# Altium schematic sheet BMS_Switch_and_batteries.SchDoc
size A4
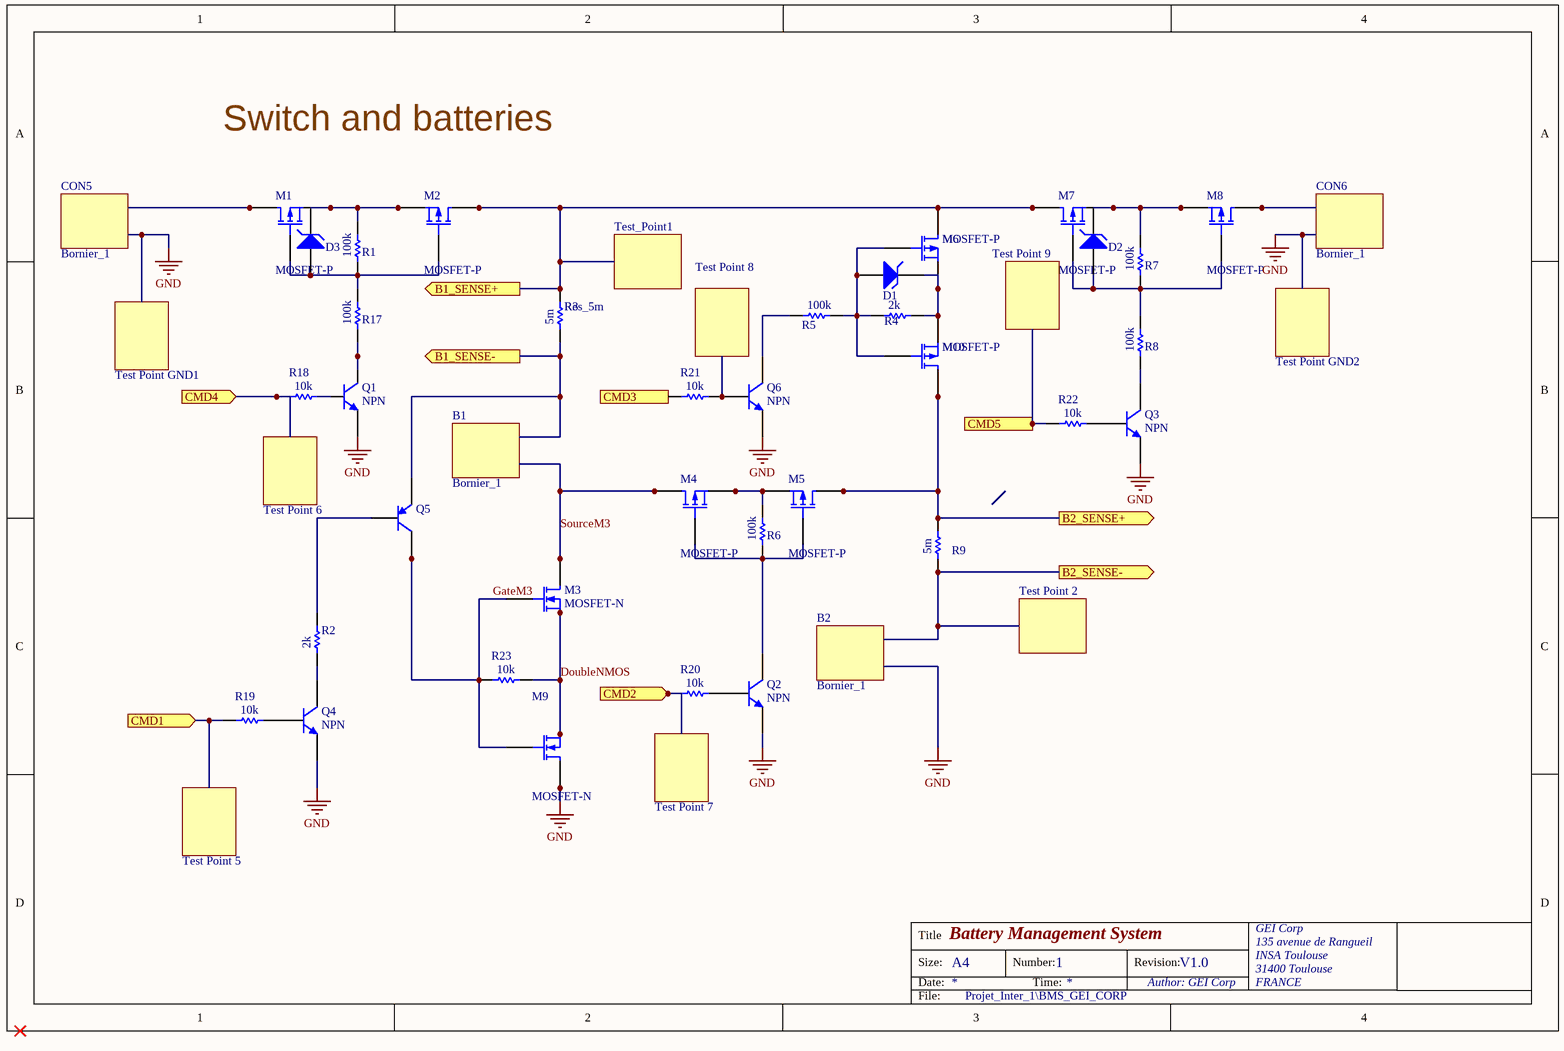
[diagram p0: BMS_Switch_and_batteries.SchDoc]

## Parts
B1  Bornier_1  [Block_2Position]
B2  Bornier_1  [Block_2Position]
CON5  Bornier_1  [Block_2Position]
CON6  Bornier_1  [Block_2Position]
D1  D Zener  [SOT95P230X110-3N_ZENER]  (value not drawn)
D2  D Zener  [SOT95P230X110-3N_ZENER]  (value not drawn)
D3  D Zener  [SOT95P230X110-3N_ZENER]  (value not drawn)
M1  MOSFET-P  [Vishay_S17-0173-SINGLE_MFG]
M2  MOSFET-P  [Vishay_S17-0173-SINGLE_MFG]
M3  MOSFET-N  [Vishay_S17-0173-SINGLE_MFG]
M4  MOSFET-P  [Vishay_S17-0173-SINGLE_MFG]
M5  MOSFET-P  [Vishay_S17-0173-SINGLE_MFG]
M6  MOSFET-P  [Vishay_S17-0173-SINGLE_MFG]
M7  MOSFET-P  [Vishay_S17-0173-SINGLE_MFG]
M8  MOSFET-P  [Vishay_S17-0173-SINGLE_MFG]
M9  MOSFET-N  [Vishay_S17-0173-SINGLE_MFG]
M10  MOSFET-P  [Vishay_S17-0173-SINGLE_MFG]
Q1  NPN  [SOT95P237X111-3N_NPN]
Q2  NPN  [SOT95P237X111-3N_NPN]
Q3  NPN  [SOT95P237X111-3N_NPN]
Q4  NPN  [SOT95P237X111-3N_NPN]
Q5  PNP  [SOT230P700X180-4N]  (value not drawn)
Q6  NPN  [SOT95P237X111-3N_NPN]
R1  Res_100k  [C0805]  (value not drawn)
R2  Res_2k  [C0805]  (value not drawn)
R3  Res_5m  [RES_WSHM2818_VIS-M]
R4  Res_2k  [C0805]  (value not drawn)
R5  Res_100k  [C0805]  (value not drawn)
R6  Res_100k  [C0805]  (value not drawn)
R7  Res_100k  [C0805]  (value not drawn)
R8  Res_100k  [C0805]  (value not drawn)
R9  Res_5m  [RES_WSHM2818_VIS-M]  (value not drawn)
R17  Res_100k  [C0805]  (value not drawn)
R18  Res_10k  [C0805]  (value not drawn)
R19  Res_10k  [C0805]  (value not drawn)
R20  Res_10k  [C0805]  (value not drawn)
R21  Res_10k  [C0805]  (value not drawn)
R22  Res_10k  [C0805]  (value not drawn)
R23  Res_10k  [C0805]  (value not drawn)
Test_Point1  Header_1  [PIN1]  (value not drawn)
Test_Point_2  Header_1  [PIN1]  (value not drawn)
Test_Point_5  Header_1  [PIN1]  (value not drawn)
Test_Point_6  Header_1  [PIN1]  (value not drawn)
Test_Point_7  Header_1  [PIN1]  (value not drawn)
Test_Point_8  Header_1  [PIN1]  (value not drawn)
Test_Point_9  Header_1  [PIN1]  (value not drawn)
Test_Point_GND1  Header_1  [PIN1]  (value not drawn)
Test_Point_GND2  Header_1  [PIN1]  (value not drawn)

## Ports
B1_SENSE+ (out), B1_SENSE- (out), B2_SENSE+ (out), B2_SENSE- (out), CMD1 (in), CMD2 (in), CMD3 (in), CMD4 (in), CMD5 (in)

## Nets
GND: B2.2 CON5.2 CON6.2 M9.5(D) M9.6(D) M9.7(D) M9.8(D) Q1.2(E) Q2.2(E) Q3.2(E) Q4.2(E) Q6.2(E) Test_Point_GND1.1 Test_Point_GND2.1
B1_SENSE+: M2.5(D) M2.6(D) M2.7(D) M2.8(D) M6.5(D) M6.6(D) M6.7(D) M6.8(D) M7.5(D) M7.6(D) M7.7(D) M7.8(D) R3.2 Test_Point1.1 ; port B1_SENSE+
B1_SENSE-: B1.1 Q5.3(E) R3.1 ; port B1_SENSE-
B2_SENSE+: M5.5(D) M5.6(D) M5.7(D) M5.8(D) M10.5(D) M10.6(D) M10.7(D) M10.8(D) R9.2 ; port B2_SENSE+
B2_SENSE-: B2.1 R9.1 Test_Point_2.1 ; port B2_SENSE-
CMD1: R19.1 Test_Point_5.1 ; port CMD1
CMD2: R20.1 Test_Point_7.1 ; port CMD2
CMD3: R21.1 ; port CMD3
CMD4: R18.1 Test_Point_6.1 ; port CMD4
CMD5: R22.1 Test_Point_9.1 ; port CMD5
DoubleNMOS: M3.1(S) M3.2(S) M3.3(S) M9.1(S) M9.2(S) M9.3(S) R23.2
GateM3: M3.4(G) M9.4(G) Q5.2(C) Q5.4(C) R23.1
SourceM3: B1.2 M3.5(D) M3.6(D) M3.7(D) M3.8(D) M4.5(D) M4.6(D) M4.7(D) M4.8(D)
NetCON5_1: CON5.1 M1.5(D) M1.6(D) M1.7(D) M1.8(D)
NetCON6_1: CON6.1 M8.5(D) M8.6(D) M8.7(D) M8.8(D)
NetD1_1: D1.1(A) M6.4(G) M10.4(G) R4.1 R5.2
NetD1_3: D1.3(K) M6.1(S) M6.2(S) M6.3(S) M10.1(S) M10.2(S) M10.3(S) R4.2
NetD2_1: D2.1(A) M7.4(G) M8.4(G) R7.1 R8.2
NetD2_3: D2.3(K) M7.1(S) M7.2(S) M7.3(S) M8.1(S) M8.2(S) M8.3(S) R7.2
NetD3_1: D3.1(A) M1.4(G) M2.4(G) R1.1 R17.2
NetD3_3: D3.3(K) M1.1(S) M1.2(S) M1.3(S) M2.1(S) M2.2(S) M2.3(S) R1.2
NetM4_1: M4.1(S) M4.2(S) M4.3(S) M5.1(S) M5.2(S) M5.3(S) R6.2
NetM4_4: M4.4(G) M5.4(G) Q2.3(C) R6.1
NetQ1_1: Q1.1(B) R18.2
NetQ1_3: Q1.3(C) R17.1
NetQ2_1: Q2.1(B) R20.2
NetQ3_1: Q3.1(B) R22.2
NetQ3_3: Q3.3(C) R8.1
NetQ4_1: Q4.1(B) R19.2
NetQ4_3: Q4.3(C) R2.1
NetQ5_1: Q5.1(B) R2.2
NetQ6_1: Q6.1(B) R21.2 Test_Point_8.1
NetQ6_3: Q6.3(C) R5.1

## Notes on the sheet
- Switch and batteries
- Title
- Size:
- Date:
- Battery Management System
- A4
- Number:
- Time:
- 1
- Revision:
- Author: GEI Corp
- V1.0
- GEI Corp
- 135 avenue de Rangueil
- INSA Toulouse
- 31400 Toulouse
- FRANCE
- File:
- Projet_Inter_1\BMS_GEI_CORP
- (in symbol Res_2k) 2k
- (in symbol Res_5m) 5m
- (in symbol Res_10k) 10k
- (in symbol Res_100k) 100k

## Library data of the parts
B1 B2 CON5 CON6 = Bornier_1: Bornier à vis
D1-D3 = D Zener: Zener Diode; Published: 8-Jun-2000; LatestRevisionDate: 17-Jul-2002; LatestRevisionNote: Re-released for DXP Platform.; PackageReference: DIODE-0.7; Publisher: Altium Limited; PackageDescription: Diode, Thru-Hole; 2 Leads; 0.7 in Pin Spacing
M1 M2 M4-M8 M10 = MOSFET-P: P-Channel MOSFET; Published: 8-Jun-2000; LatestRevisionDate: 17-Jul-2002; LatestRevisionNote: Re-released for DXP Platform.; PackageVersion: 1995/1996; PackageReference: E3; Publisher: Altium Limited; PackageDescription: TO, Flat Index; 3 In-Line, Axial Leads; Body Dia. 4.6mm; Lead Dia. 0.5 mm (max)
M3 M9 = MOSFET-N: N-Channel MOSFET; Published: 8-Jun-2000; LatestRevisionDate: 17-Jul-2002; LatestRevisionNote: Re-released for DXP Platform.; PackageVersion: 1995/1996; PackageReference: E3; Publisher: Altium Limited; PackageDescription: TO, Flat Index; 3 In-Line, Axial Leads; Body Dia. 4.6mm; Lead Dia. 0.5 mm (max)
Q1-Q4 Q6 = NPN: NPN Bipolar Transistor; Published: 8-Jun-2000; LatestRevisionDate: 17-Jul-2002; LatestRevisionNote: Re-released for DXP Platform.; PackageReference: TO-226-AA; Publisher: Altium Limited; PackageDescription: TO, Flat Index; 3 In-Line, Axial Leads; Body Dia. 4.8mm; Leads 0.55 x 0.51 mm (max); Code_JEDEC: TO-226-AA
Q5 = PNP: PNP Bipolar Transistor; Published: 8-Jun-2000; LatestRevisionDate: 29-May-2009; LatestRevisionNote: IPC-7351 Footprint Added.; PackageVersion: Aug-1999; PackageReference: SOT-23B; Publisher: Altium Limited; PackageDescription: 3-Pin SOT-23 Package 0.95 mm Pitch, 2.4 mm Lead Span
R1 R5-R8 R17 = Res_100k: Resistor
R2 R4 = Res_2k: Resistor
R3 R9 = Res_5m: Resistor
R18-R23 = Res_10k: Resistor
Test_Point1 Test_Point_2 Test_Point_5-Test_Point_9 Test_Point_GND1 Test_Point_GND2 = Header_1: Header 1-pin